# EasyEDA Pro project 51PCB_Project.eprj, schematic Schematic1
Board Name: Board1; Create Date: 2024-12-29; Page Name: P1; Project Name: 51PCB_Project_2024-12-29_14-04-50; Schematic Name: Schematic1; Update Date: 2024-12-30; Company: 嘉立创EDA; Page Size: A3; Version: V1.0
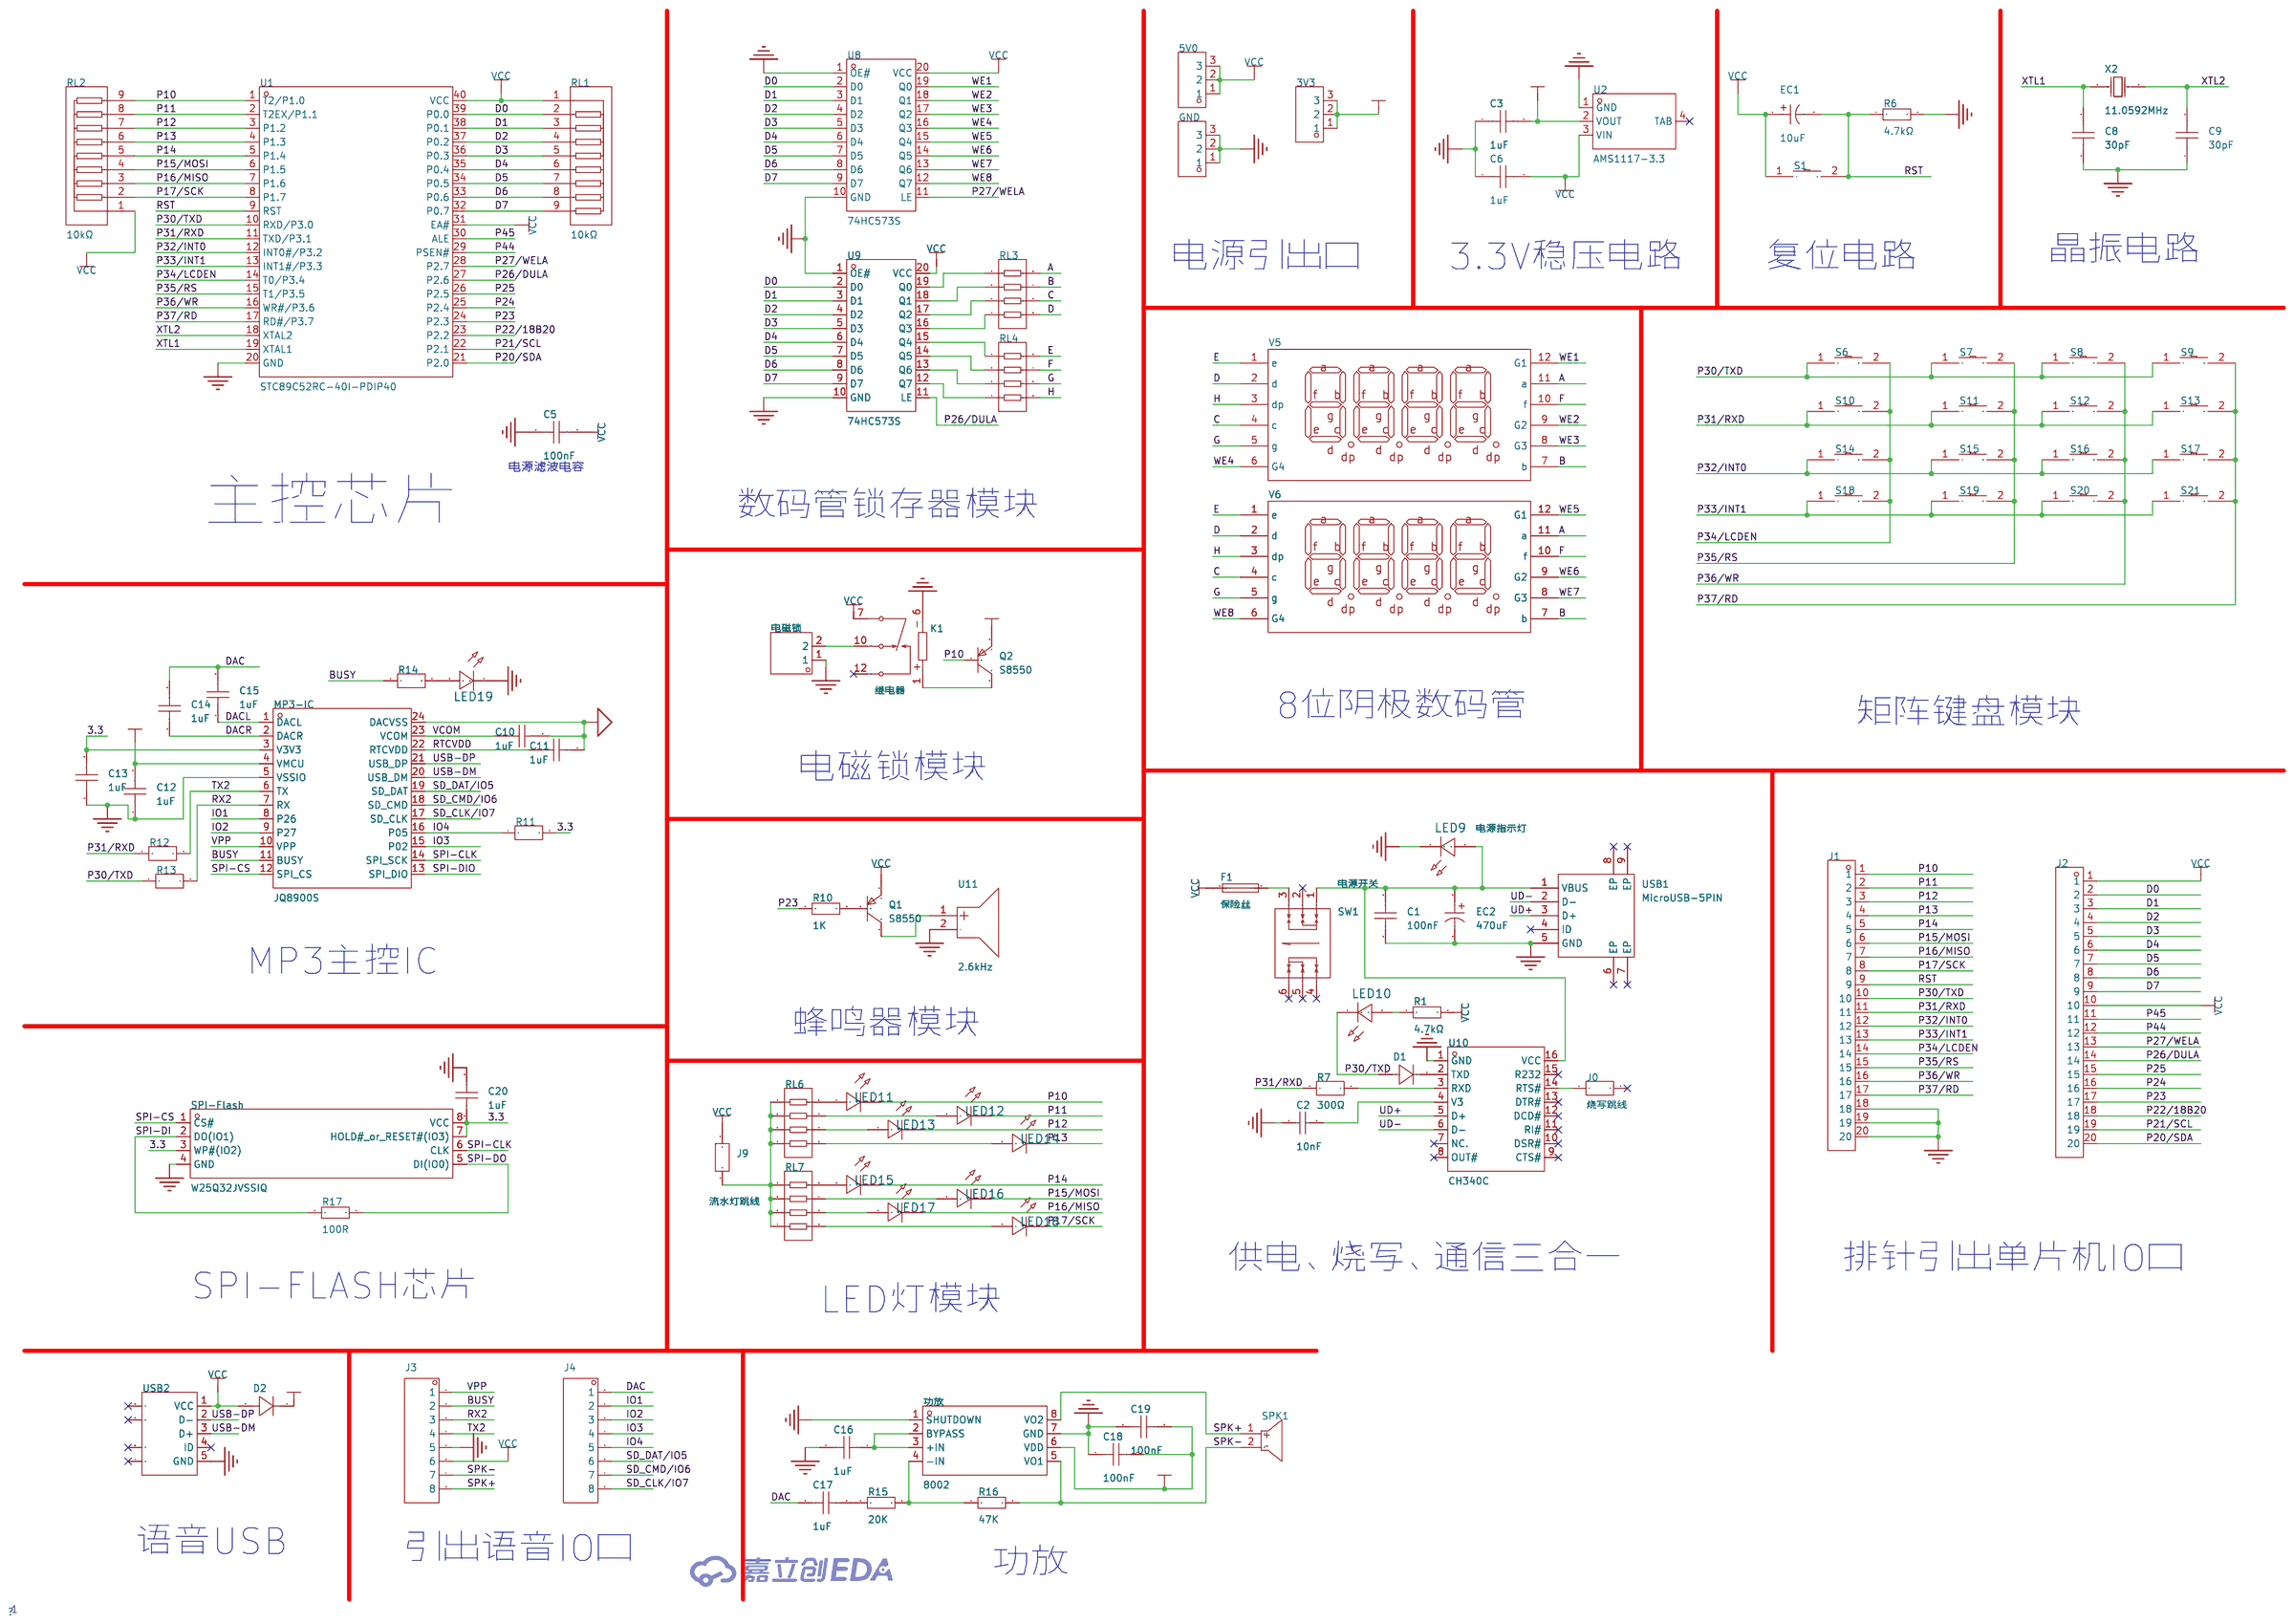
[diagram p0: schematic sheet]

## Parts
3V3  -  [HDR-TH_3P-P2.54-V-M]
5V0  -  [HDR-TH_3P-P2.54-V-M]
C1  100nF  [CAP-TH_L6.5-W3.5-P2.50-D0.6-S2.90]
C2  10nF  [C1206]
C3  1uF  [CAP-TH_L5.5-W3.5-P5.00-D1.2]
C5  100nF  [CAP-TH_L5.0-W2.5-P5.00-D1.0]
C6  1uF  [CAP-TH_L5.5-W3.5-P5.00-D1.2]
C8  30pF  [CAP-TH_L5.0-W3.0-P5.00-D1.0]
C9  30pF  [CAP-TH_L5.0-W3.0-P5.00-D1.0]
C10  1uF  [CAP-TH_L5.5-W3.5-P5.00-D1.2]
C11  1uF  [CAP-TH_L5.5-W3.5-P5.00-D1.2]
C12  1uF  [CAP-TH_L5.5-W3.5-P5.00-D1.2]
C13  1uF  [CAP-TH_L5.5-W3.5-P5.00-D1.2]
C14  1uF  [CAP-TH_L5.5-W3.5-P5.00-D1.2]
C15  1uF  [CAP-TH_L5.5-W3.5-P5.00-D1.2]
C16  1uF  [CAP-TH_L5.5-W3.5-P5.00-D1.2]
C17  1uF  [CAP-TH_L5.5-W3.5-P5.00-D1.2]
C18  100nF  [C0603]
C19  100nF  [C0603]
C20  1uF  [CAP-TH_L5.5-W3.5-P5.00-D1.2]
D1  -  [DO_1N4007]
D2  -  [DO_1N4007]
EC1  10uF  [CAP-SMD_BD6.3-L6.6-W6.6-LS7.2-FD]
EC2  470uF  [CAP-TH_BD16.0-P7.50-D1.2-FD]
F1  保险丝  [F1812]
GND  -  [HDR-TH_3P-P2.54-V-M]
J0  烧写跳线  [CONN-TH_D3086XX]
J1  -  [HDR-TH_20P-P2.54-V-M-1]
J2  -  [HDR-TH_20P-P2.54-V-M-1]
J3  -  [HDR-TH_8P-P2.54-V-M]
J4  -  [HDR-TH_8P-P2.54-V-M]
J9  流水灯跳线  [CONN-TH_D3086XX]
K1  继电器  [RELAY-TH_DS1E-S-DC24V]
LED9  电源指示灯  [LED_0805]
LED10  -  [LED_0805]
LED11  -  [LED_0805]
LED12  -  [LED_0805]
LED13  -  [LED_0805]
LED14  -  [LED_0805]
LED15  -  [LED_0805]
LED16  -  [LED_0805]
LED17  -  [LED_0805]
LED18  -  [LED_0805]
LED19  -  [LED_0805]
MP3-IC  JQ8900S  [TSSOP-24_L7.8-W4.4-P0.65-LS6.4-BL_1]
Q1  S8550  [SOT-23-3_L2.9-W1.3-P1.90-LS2.4-BR]
Q2  S8550  [SOT-23-3_L2.9-W1.3-P1.90-LS2.4-BR]
R1  4.7kΩ  [R1206]
R6  4.7kΩ  [RES-TH_BD1.9-L3.3-P7.30-D0.5]
R7  300Ω  [R1206]
R10  1K  [R1206]
R11  300Ω  [R1206]
R12  300Ω  [R1206]
R13  300Ω  [R1206]
R14  300Ω  [R1206]
R15  20K  [R0603]
R16  47K  [R0603]
R17  100R  [R0603]
RL1  10kΩ  [RES-ARRAY-TH_9P-P2.54-D1.0]
RL2  10kΩ  [RES-ARRAY-TH_9P-P2.54-D1.0]
RL3  470Ω  [RES-ARRAY-TH_8P-P2.54-D1.0]
RL4  470Ω  [RES-ARRAY-TH_8P-P2.54-D1.0]
RL6  470Ω  [RES-ARRAY-TH_8P-P2.54-D1.0]
RL7  470Ω  [RES-ARRAY-TH_8P-P2.54-D1.0]
S1  TS-1101-C-W  [SW-SMD_L6.0-W3.3-LS8.0]
S6  TS-1101-C-W  [SW-SMD_L6.0-W3.3-LS8.0]
S7  TS-1101-C-W  [SW-SMD_L6.0-W3.3-LS8.0]
S8  TS-1101-C-W  [SW-SMD_L6.0-W3.3-LS8.0]
S9  TS-1101-C-W  [SW-SMD_L6.0-W3.3-LS8.0]
S10  TS-1101-C-W  [SW-SMD_L6.0-W3.3-LS8.0]
S11  TS-1101-C-W  [SW-SMD_L6.0-W3.3-LS8.0]
S12  TS-1101-C-W  [SW-SMD_L6.0-W3.3-LS8.0]
S13  TS-1101-C-W  [SW-SMD_L6.0-W3.3-LS8.0]
S14  TS-1101-C-W  [SW-SMD_L6.0-W3.3-LS8.0]
S15  TS-1101-C-W  [SW-SMD_L6.0-W3.3-LS8.0]
S16  TS-1101-C-W  [SW-SMD_L6.0-W3.3-LS8.0]
S17  TS-1101-C-W  [SW-SMD_L6.0-W3.3-LS8.0]
S18  TS-1101-C-W  [SW-SMD_L6.0-W3.3-LS8.0]
S19  TS-1101-C-W  [SW-SMD_L6.0-W3.3-LS8.0]
S20  TS-1101-C-W  [SW-SMD_L6.0-W3.3-LS8.0]
S21  TS-1101-C-W  [SW-SMD_L6.0-W3.3-LS8.0]
SPI-Flash  W25Q32JVSSIQ  [SOIC-8_L5.3-W5.3-P1.27-LS8.0-BL]
SPK1  FS-2308  [BEEP-TH_BD23.2-P9.20-D1.0]
SW1  电源开关  [SW-TH_6P-L8.0-W8.0-P2.50]
U1  STC89C52RC-40I-PDIP40  [DIP-40_L52.0-W13.7-P2.54-LS15.2-BL]
U2  AMS1117-3.3  [SOT-223-3_L6.5-W3.5-P3.05-LS7.0]
U8  74HC573S  [SOIC-20_L13.0-W7.6-P1.27-LS10.3-BL]
U9  74HC573S  [SOIC-20_L13.0-W7.6-P1.27-LS10.3-BL]
U10  CH340C  [SOP-16_L10.0-W3.9-P1.27-LS6.0-BL]
U11  2.6kHz  [BUZ-TH_BD12.0-P7.60-D0.6-FD]
USB1  MicroUSB-5PIN  [USB-SMD_5P_MICROUSB-5PIN]
USB2  -  [USB_MINI-5P]
V5  FJ3461AH  [LED-SEG-TH_12P-L30.0-W14.0-P2.54-S10.16-BL]
V6  FJ3461AH  [LED-SEG-TH_12P-L30.0-W14.0-P2.54-S10.16-BL]
X2  11.0592MHz  [HC-49US_L11.5-W4.5-P4.88]
功放  8002  [SOP-8_L4.9-W3.9-P1.27-LS6.0-BL]
电磁锁  -  [HDR-TH_2P-P2.54-V-M-1]

## Library data of the parts
3V3 5V0 GND = HDR-M_2.54_1x3P: Supplier Part: C2937625; Supplier Footprint: 插件
C1 = CC1H104ZA1FD3F6C1100: 容值:100nF;精度:-20%~+80%;额定电压:50V;温度系数:Y5V;; LCSC Part Name: 100nF -20%~+80% 50V; Supplier Part: C5442939; Manufacturer: Dersonic(德尔创); Supplier Footprint: 插件,P=2.54mm; JLCPCB Part Class: 扩展库; Datasheet: https://atta.szlcsc.com/upload/public/pdf/source/20240808/2E4F22AECAD8A963CB56DA9A5AABDB6C.pdf; Supplier: LCSC; Tolerance: -20%~+80%; Voltage Rated: 50V; Lead Spacing: 2.54mm; Temperature Coefficient: Y5V; Diameter: 6.3mm; Body Thickness: 2.6mm
C2 = 1206B103K500NT: 容值:10nF;精度:±10%;额定电压:50V;材质(温度系数):X7R;; LCSC Part Name: 10nF ±10% 50V; Supplier Part: C1846; Manufacturer: FH(风华); Supplier Footprint: 1206; JLCPCB Part Class: 基础库; Datasheet: https://atta.szlcsc.com/upload/public/pdf/source/20200305/C486355_26A10D38EF8C2A5C37091D0039909270.pdf; Supplier: LCSC; Tolerance: ±10%; Voltage Rated: 50V; Temperature Coefficient: X7R
C3 C6 C10-C17 C20 = FK26X7R1H105KRE06: 容值:1uF;精度:±10%;额定电压:50V;温度系数:X7R;; LCSC Part Name: 1uF ±10% 50V; Supplier Part: C2839237; Manufacturer: TDK; Supplier Footprint: 插件,P=5mm; JLCPCB Part Class: 扩展库; Datasheet: https://atta.szlcsc.com/upload/public/pdf/source/20211011/CA0C243CD946D294CDFF83D03DB16AD9.pdf; Supplier: LCSC; Tolerance: ±10%; Voltage Rated: 50V; Lead Spacing: 5mm; Temperature Coefficient: X7R
C5 = CC1H104MC1FD3F6C10MF: 容值:100nF;精度:±20%;额定电压:50V;温度系数:Y5V;; LCSC Part Name: 100nF ±20% 50V; Supplier Part: C254085; Manufacturer: Dersonic(德尔创); Supplier Footprint: 插件,P=5.08mm; JLCPCB Part Class: 扩展库; Datasheet: https://atta.szlcsc.com/upload/public/pdf/source/20200826/C254085_159DD65BF32BF11C9168D341BCE23E6F.pdf; Supplier: LCSC; Tolerance: ±20%; Voltage Rated: 50V; Lead Spacing: 5.08mm; Temperature Coefficient: Y5V; φD: 6mm; Body Thickness: 2.2mm
C8 C9 = DCC300J20COHF6FJ5A0: 容值:30pF;精度:±5%;额定电压:50V;温度系数:-;; LCSC Part Name: 30pF ±5% 50V; Supplier Part: C2896130; Manufacturer: SHM(南方宏明); Supplier Footprint: 插件,P=5mm; JLCPCB Part Class: 扩展库; Datasheet: https://atta.szlcsc.com/upload/public/pdf/source/20210929/2675BE423E96B4772DBF330AE545E239.pdf; Supplier: LCSC; Tolerance: ±5%; Voltage Rated: 50V; Lead Spacing: 5mm
C18 C19 = CAP_0603: Supplier Footprint: 0603
D1 D2 = D_1N4007A: Supplier Footprint: DO-41
EC1 = MVK50V10M6.3*5: 容值:10uF;精度:±20%;额定电压:50V;纹波电流:29mA@120Hz;; LCSC Part Name: 10uF ±20% 50V; Supplier Part: C20539336; Manufacturer: SAMYOUNG(韩国三莹); Supplier Footprint: SMD,D6xL5mm; JLCPCB Part Class: 扩展库; Datasheet: https://atta.szlcsc.com/upload/public/pdf/source/20240521/5D58DF344D335CF011E1C9E4B9E4E338.pdf; Supplier: LCSC; Tolerance: ±20%; Rated Voltage: 50V; Ripple Current: 29mA@120Hz; φD: 6.3mm; L: 5mm; Lifetime @ Temp: 1000hrs@105℃; Operating Temperature: -40℃~+105℃
EC2 = NXH100VB470M16*31.5 LO: 容值:470uF;精度:±20%;额定电压:100V;纹波电流:2.4A@100kHz;等效串联电阻:33mΩ@100kHz;; LCSC Part Name: 470uF ±20% 100V; Supplier Part: C18164658; Manufacturer: SAMYOUNG(韩国三莹); Supplier Footprint: 插件,D16xL31.5mm; JLCPCB Part Class: 扩展库; Datasheet: https://atta.szlcsc.com/upload/public/pdf/source/20230919/BD77242C9D8CDAC24569F504DC077A1F.pdf; Supplier: LCSC; Tolerance: ±20%; Rated Voltage: 100V; Ripple Current: 2.4A@100kHz; Equivalent Series Resistance(ESR): 33mΩ@100kHz; Lead Spacing: 7.5mm; φD: 16mm; L: 31.5mm; Lifetime @ Temp: 10000hrs@105℃; Operating Temperature: -40℃~+105℃
F1 = BSMD1812-050-33V: 最大电压:33V;最大电流:40A;保持电流:500mA;跳闸电流:1A;; LCSC Part Name: 1812 0.5A 33V 自恢复; Supplier Part: C19673875; Manufacturer: BHFUSE(佰宏); Supplier Footprint: 1812; JLCPCB Part Class: 扩展库; Datasheet: https://atta.szlcsc.com/upload/public/pdf/source/20231215/5A8D3E85C128E7D194F97EE066518474.pdf; Supplier: LCSC; Operating Voltage (Max): 33V; Current Rating (Max): 40A; Hold Current: 500mA; Trip Current: 1A; Power Dissipation: 800mW; Resistance - Initial (Ri) (Min): 150mΩ; Resistance - Post Trip (R1) (Max): 1.4Ω; Maximum Time to Trip: 150ms; Operating Temperature: -40℃~+85℃
J0 J9 = D3086-97: LCSC Part Name: 跳线(母线), 短路, 短路链接, H3161, H3163系列 PC板插座, 2 路, 5.08 mm, Harwin - D308; Supplier Part: C20627105; Manufacturer: Harwin; JLCPCB Part Class: 扩展库; Datasheet: https://atta.szlcsc.com/upload/public/pdf/source/20240229/F1227681D81E34D7B1C6299A6A390718.pdf; Supplier: LCSC
J1 J2 = HDR-M_2.54_1x20P: 间距:2.54mm;总PIN位数:20;排数:1;插针结构:-;行距:-;安装类型:直插;圆针/方针:-;额定电流:-;额定电压:-;配合针长度:-;塑高:-;触头材质:黄铜;触头镀层:-;颜色:黑色;; Supplier Part: C50981; Supplier Footprint: 插件
J3 J4 = HDR-M_2.54_1x8P: Supplier Part: C124381; Supplier Footprint: 插件
K1 = DS1E-M-DC12V: 线圈电压:12V;触点形式:一组转换:1C(单刀双掷-转换);触点容量(电阻负载):-;最大切换电压:250V@AC；220V@DC;最大切换电流:2A;; Supplier Part: C4402944; Manufacturer: PANASONIC(松下); Supplier Footprint: 插件,9.9x15mm; JLCPCB Part Class: 扩展库; Datasheet: https://atta.szlcsc.com/upload/public/pdf/source/20220714/971BAC34C55B3A522BD74814F24FED99.pdf; Supplier: LCSC; Coil Voltage: 12V; Contact Form: 一组转换:1C(单刀双掷-转换); Maximum Switching Voltage: 250V@AC；220V@DC; Contact Material: 银+镀金; Maximum Switching Current: 2A; Operate Time: 10ms; Release Time: 5ms; Operating Temperature: -40℃~+70℃
LED9-LED19 = LED_0805-R: Supplier Footprint: 0805
MP3-IC = JQ8900S: Supplier Part: C9900042556; Supplier Footprint: TSSOP24; Supplier: LCSC
Q1 Q2 = S8550: LCSC Part Name: PNP -25V -500mA 120-400 SOT-23; Supplier Part: C2931720; Manufacturer: Doeshare(德芯); Supplier Footprint: SOT-23; JLCPCB Part Class: 扩展库; Datasheet: https://atta.szlcsc.com/upload/public/pdf/source/20220104/15A23F6542E365B9E2BA018BE45092B6.pdf; Supplier: LCSC
R1 = 1206W4F4701T5E: 电阻类型:厚膜电阻;阻值:4.7kΩ;精度:±1%;功率:250mW;最大工作电压:200V;温度系数:±100ppm/℃;; LCSC Part Name: 4.7kΩ ±1% 250mW 厚膜电阻; Supplier Part: C17936; Manufacturer: UNI-ROYAL(厚声); Supplier Footprint: 1206; JLCPCB Part Class: 基础库; Datasheet: https://atta.szlcsc.com/upload/public/pdf/source/20200306/C422600_1E6D84923E4A46A82E41ADD87F860B5C.pdf; Supplier: LCSC; Type: 厚膜电阻; Tolerance: ±1%; Power(Watts): 250mW; Overload Voltage (Max): 200V; Temperature Coefficient: ±100ppm/℃; Operating Temperature Range: -55℃~+155℃
R6 = MFR0W8F4701A50: 电阻类型:金属膜电阻;阻值:4.7kΩ;精度:±1%;功率:125mW;温度系数:±50ppm/℃;; LCSC Part Name: 4.7kΩ ±1% 125mW 金属膜电阻; Supplier Part: C58678; Manufacturer: UNI-ROYAL(厚声); Supplier Footprint: 插件,D1.9xL3.3mm; JLCPCB Part Class: 扩展库; Datasheet: https://atta.szlcsc.com/upload/public/pdf/source/20191012/C436293_8820AA14BC71FA35E551C06C441482A0.pdf; Supplier: LCSC; Type: 金属膜电阻; Tolerance: ±1%; Overload Voltage (Max): 200V; Power(Watts): 125mW; Temperature Coefficient: ±50ppm/℃
R7 R11-R14 = FRC1206J301 TS: 电阻类型:厚膜电阻;阻值:300Ω;精度:±5%;功率:250mW;最大工作电压:200V;温度系数:±100ppm/℃;; LCSC Part Name: 300Ω ±5% 250mW 厚膜电阻; Supplier Part: C3013269; Manufacturer: FOJAN(富捷); Supplier Footprint: 1206; JLCPCB Part Class: 扩展库; Datasheet: https://atta.szlcsc.com/upload/public/pdf/source/20211221/925EC7D7225764EE0046F22065062C87.pdf; Supplier: LCSC; Type: 厚膜电阻; Tolerance: ±5%; Power(Watts): 250mW; Overload Voltage (Max): 200V; Temperature Coefficient: ±100ppm/℃
R10 = Res_1206: Supplier Footprint: 1206
R15-R17 = Res_0603: Supplier Footprint: 0603
RL1 RL2 = A09-103GP: 电阻器数:8;阻值:10kΩ;精度:±2%;单个元件功率:125mW;温度系数:±100ppm/℃;; LCSC Part Name: 10kΩ ±2%; Supplier Part: C1322401; Manufacturer: FH(风华); Supplier Footprint: SIP-9-2.54mm; JLCPCB Part Class: 扩展库; Datasheet: https://atta.szlcsc.com/upload/public/pdf/source/20181127/C336620_2E84FA9E7B5BF76546BC661699514FB8.pdf; Supplier: LCSC; Number of Resistors: 8; Tolerance: ±2%; Power(Watts): 125mW; Temperature Coefficient: ±100ppm/℃; Number of Pins: 9
RL3 RL4 RL6 RL7 = 4608X-102-471LF: 电阻器数:4;阻值:470Ω;精度:±2%;单个元件功率:300mW;温度系数:±100ppm/℃;; LCSC Part Name: 470Ω ±2%; Supplier Part: C1357983; Manufacturer: BOURNS; Supplier Footprint: SIP-8-2.54mm; JLCPCB Part Class: 扩展库; Datasheet: https://atta.szlcsc.com/upload/public/pdf/source/20210602/12BA461036BFCE8593BA6D5AE69068B1.pdf; Supplier: LCSC; Number of Resistors: 4; Tolerance: ±2%; Power(Watts): 300mW; Temperature Coefficient: ±100ppm/℃; Number of Pins: 8
S1 S6-S21 = TS-1101-C-W: 电路结构:单刀单掷;按钮形状:矩形按钮;作用力:260gf;安装方式:立贴;开关长度:6mm;开关宽度:3.6mm;开关高度:2.5mm;带支架:不带;触点电流:50mA;额定电压(AC):-;额定电压(DC):12V;额定功率:-;绝缘电阻:-;带灯:无;机械寿命:5万次;; LCSC Part Name: 6*3.6*2.5mm 立贴 轻触开关; Supplier Part: C318938; Manufacturer: XKB Connectivity(中国星坤); Supplier Footprint: SMD; JLCPCB Part Class: 扩展库; Datasheet: https://atta.szlcsc.com/upload/public/pdf/source/20200227/C318938_C2E53B1EEDE37D980A33616AC086DE53.pdf; Supplier: LCSC; Circuit: 单刀单掷; Actuator Style: 矩形按钮; Operating Force: 260gf; Mounting Style: 立贴; Switch Length: 6mm; Switch Width: 3.6mm; Switch Height: 2.5mm; Strike Gundam: 不带; Contact Current: 50mA; Voltage Rating (DC): 12V; Actuator/Cap Color: 白色带淡绿; With Lamp: 无; Mechanical Life: 5万次; Operating Temperature: -30℃~+85℃
SPI-Flash = W25Q32JVSSIQ: Supplier Part: C179173; Manufacturer: WINBOND(华邦); Supplier Footprint: SOIC-8-208mil; JLCPCB Part Class: 扩展库; Datasheet: https://atta.szlcsc.com/upload/public/pdf/source/20191218/C179173_5BBD793D2D7B3672E140BC7AE85C11FF.pdf; Supplier: LCSC
SPK1 = FS-2308: LCSC Part Name: 喇叭23MM-8.0H 8Ω1W 插针; Supplier Part: C482322; Manufacturer: FUET(福声科技); JLCPCB Part Class: 扩展库; Datasheet: https://atta.szlcsc.com/upload/public/pdf/source/20200113/C482322_D09CD61BAFBB8D4AD64070E01BFD18FF.pdf; Supplier: LCSC
SW1 = 8-8 ZS: 电路结构:双刀双掷;自锁/无锁:自锁;安装方式:直插;触点电流:100mA;额定电压 (AC):-;额定电压 (DC):30V;带灯:不带;作用力:180gf;机械寿命:5千次;; LCSC Part Name: 按键开关8x8 自锁高头 180gf; Supplier Part: C5379893; Manufacturer: SHOU HAN(首韩); Supplier Footprint: 插件; JLCPCB Part Class: 扩展库; Datasheet: https://atta.szlcsc.com/upload/public/pdf/source/20230920/344D9C55231D4D6DD37BED301252459B.pdf; Supplier: LCSC; Circuit: 双刀双掷; Self Lock / No Lock: 自锁; Actuator Style: 矩形柱塞; Mounting Style: 直插; Contact Current: 100mA; Voltage Rating (DC): 30V; Insulation Resistance: 100MΩ; Actuator/Cap Color: 蓝色; With Lamp: 不带; Pin Style: PC引脚; Operating Force: 180gf; Operating Temperature: -10℃~+70℃; Mechanical Life: 5千次
U1 = STC89C52RC-40I-PDIP40: CPU内核:51系列;程序存储容量:8KB;RAM总容量:512Byte;GPIO端口数量:35;工作电压范围:3.3V~5.5V;CPU最大主频:-;程序存储器类型:FLASH;; Supplier Part: C14022; Manufacturer: STC(宏晶); Supplier Footprint: DIP-40; JLCPCB Part Class: 扩展库; Datasheet: https://atta.szlcsc.com/upload/public/pdf/source/20210104/C14022_3E6032FDBB5DBC6F971AD019A8472F5B.pdf; Supplier: LCSC; CPU Core: 51系列; Program Storage Size: 8KB; RAM Size: 512Byte; GPIO Ports Number: 35; Operating Voltage Range: 3.3V~5.5V; Program Memory Type: FLASH; Operating Temperature Range: -40℃~+85℃; 16Bit Timer: 3; UART/USART: 1; Peripheral/Function: 看门狗; Watchdog: 有
U2 = AMS1117-3.3_C5250992: 输出类型:固定;工作电压:12V;输出电压:3.3V;输出电流:1A;电源纹波抑制比(PSRR):70dB@(120Hz);输出极性:正极;; Supplier Part: C5250992; Manufacturer: TWGMC(台湾迪嘉); Supplier Footprint: SOT-223-3L; JLCPCB Part Class: 扩展库; Datasheet: https://atta.szlcsc.com/upload/public/pdf/source/20221109/A58A92B07670E85D28928AE371260E8D.pdf; Supplier: LCSC; Output Type: 固定; Maximum Input Voltage: 12V; Output Voltage: 3.3V; Output Current: 1A; Power Supply Rejection Ratio (PSRR): 70dB@(120Hz); Operating Temperature: -40℃~+125℃@(Tj); Output Polarity: 正极; Number of Outputs: 1
U8 U9 = 74HC573S: Supplier Part: C19818872; Manufacturer: GR(国睿); Supplier Footprint: SOIC-20-300mil; JLCPCB Part Class: 扩展库; Datasheet: https://atta.szlcsc.com/upload/public/pdf/source/20231226/FCD51D65E6130A1C21F1588DDAB191FD.pdf; Supplier: LCSC
U10 = CH340C: 应用功能:收发器;接口协议:USB 2.0;数据速率:2Mbps;; LCSC Part Name: CH340C USB转串口芯片 CH340; Supplier Part: C84681; Manufacturer: WCH(南京沁恒); Supplier Footprint: SOP-16; JLCPCB Part Class: 扩展库; Datasheet: https://atta.szlcsc.com/upload/public/pdf/source/20240619/63986D8440D4E5267A77ACD891CC4DE3.pdf; Supplier: LCSC; Applications Function: 收发器; Protocol: USB 2.0; Supply Voltage: 3.3V；5V; Data Rate: 2Mbps
U11 = HYE1206-12ST: 频率:2.6kHz;声压(SPL):85dB@12V,10cm;; LCSC Part Name: 有源蜂鸣器HYE1206-12ST; Supplier Part: C17701080; Manufacturer: HYDZ(华宇); Supplier Footprint: 插件,D=7.6mm; Datasheet: https://atta.szlcsc.com/upload/public/pdf/source/20230912/C7366A61A43818688751ED674836836E.pdf; Supplier: LCSC; Sound Pressure Level (SPL): 85dB@12V,10cm
USB1 = MicroUSB-5PIN: Supplier Part: C9900001196; Supplier Footprint: MicroUSB-5PIN,; JLCPCB Part Class: 扩展库; Supplier: LCSC
USB2 = USB_Mini-B: Supplier Footprint: SMD; Supplier: LCSC
V5 V6 = FJ3461AH: 数码管位数:4位;功耗:-;发光颜色:红色;LED极性:共阴极;数字/字母大小(英寸):0.36;; LCSC Part Name: 4位0.36英寸红色数码管 共阴极; Supplier Part: C10708; Manufacturer: 志浩; Supplier Footprint: 插件; JLCPCB Part Class: 扩展库; Datasheet: https://atta.szlcsc.com/upload/public/pdf/source/20121231/1457706574766.pdf; Supplier: LCSC; Number of Characters: 4位; Module Size: 30mmx14mmx7.2mm; Luminous Color: 红色; LED Polarity: 共阴极; Digit/Alpha Size(inch): 0.36
X2 = X49SD110592MSD2SC: 晶振类型:直插晶振;频率:11.0592MHz;常温频差:±20ppm;外接负载电容:20pF;频率稳定度(全温):±30ppm;; LCSC Part Name: 11.0592MHz ±20ppm 20pF; Supplier Part: C2203; Manufacturer: YXC(扬兴晶振); Supplier Footprint: HC-49S; JLCPCB Part Class: 扩展库; Datasheet: https://atta.szlcsc.com/upload/public/pdf/source/20240329/977D7F2434F98B2BE33270BB9FF3D86D.pdf; Supplier: LCSC; Crystal Type: 直插晶振; Normal temperature Frequency Tolerance: ±20ppm; External load capacitor: 20pF; Frequency Stability(Full temperature range): ±30ppm; Operating Temperature: -20℃~+70℃
功放 = 8002: 功率放大器; LCSC Part Name: Aip8002; Supplier Part: C5139016; Manufacturer: I-CORE(中微爱芯); Supplier Footprint: SOP-8; JLCPCB Part Class: 扩展库; Datasheet: https://atta.szlcsc.com/upload/public/pdf/source/20220816/03501F7F7652C9F9E3FDDA0D1837E9DD.pdf; Supplier: LCSC
电磁锁 = HDR-M_2.54_1x2P: Supplier Part: C124375; Supplier Footprint: 插件

## Nets
AGND: C10.2 C11.2 MP3-IC.24(DACVSS)
GND: C1.1 C2.1 C3.1 C5.1 C6.1 C8.1 C9.1 C12.1 C13.1 C16.2 C18.1 C19.1 C20.1 EC2.2 GND.1 GND.2 GND.3 J1.18 J1.19 J1.20 J3.5 K1.6 LED9.1(C) LED19.1(C) MP3-IC.5(VSSIO) R6.2 SPI-Flash.4(GND) U1.20(GND) U2.1(GND) U8.1(OE#) U8.10(GND) U9.1(OE#) U9.10(GND) U10.1(GND) U11.2(-) USB1.5(GND) USB2.5(GND) 功放.1(SHUTDOWN) 功放.7(GND) 电磁锁.1
VCC: 5V0.1 5V0.2 5V0.3 C5.2 C6.2 D2.2(A) EC1.1 F1.1 J2.1 J2.10 J3.6 J9.2 K1.7 Q1.2(E) R1.2 RL1.1 RL2.1 S1.1 U1.31(EA#) U1.40(VCC) U2.3(VIN) U8.20(VCC) U9.20(VCC) USB2.1(VCC)
3.3: C13.2 C20.2 MP3-IC.3(V3V3) R11.2 SPI-Flash.3(WP#(IO2)) SPI-Flash.7(HOLD# or RESET#(IO3)) SPI-Flash.8(VCC)
+3.3: 3V3.1 3V3.2 3V3.3 C3.2 Q2.2(E) U2.2(VOUT)
A: RL3.8 V5.11(a) V6.11(a)
B: RL3.7 V5.7(b) V6.7(b)
BUSY: J3.2 MP3-IC.11(BUSY) R14.1
C: RL3.6 V5.4(c) V6.4(c)
D: RL3.5 V5.2(d) V6.2(d)
D0: J2.2 RL1.2 U1.39(P0.0) U8.2(D0) U9.2(D0)
D1: J2.3 RL1.3 U1.38(P0.1) U8.3(D1) U9.3(D1)
D2: J2.4 RL1.4 U1.37(P0.2) U8.4(D2) U9.4(D2)
D3: J2.5 RL1.5 U1.36(P0.3) U8.5(D3) U9.5(D3)
D4: J2.6 RL1.6 U1.35(P0.4) U8.6(D4) U9.6(D4)
D5: J2.7 RL1.7 U1.34(P0.5) U8.7(D5) U9.7(D5)
D6: J2.8 RL1.8 U1.33(P0.6) U8.8(D6) U9.8(D6)
D7: J2.9 RL1.9 U1.32(P0.7) U8.9(D7) U9.9(D7)
DAC: C14.2 C15.2 C17.2 J4.1
DACL: C15.1 MP3-IC.1(DACL)
DACR: C14.1 MP3-IC.2(DACR)
E: RL4.8 V5.1(e) V6.1(e)
F: RL4.7 V5.10(f) V6.10(f)
G: RL4.6 V5.5(g) V6.5(g)
H: RL4.5 V5.3(dp) V6.3(dp)
IO1: J4.2 MP3-IC.8(P26)
IO2: J4.3 MP3-IC.9(P27)
IO3: J4.4 MP3-IC.15(P02)
IO4: J4.5 MP3-IC.16(P05) R11.1
P10: J1.1 LED11.1(C) Q2.1(B) RL2.9 U1.1(T2/P1.0)
P11: J1.2 LED12.1(C) RL2.8 U1.2(T2EX/P1.1)
P12: J1.3 LED13.1(C) RL2.7 U1.3(P1.2)
P13: J1.4 LED14.1(C) RL2.6 U1.4(P1.3)
P14: J1.5 LED15.1(C) RL2.5 U1.5(P1.4)
P15/MOSI: J1.6 LED16.1(C) RL2.4 U1.6(P1.5)
P16/MISO: J1.7 LED17.1(C) RL2.3 U1.7(P1.6)
P17/SCK: J1.8 LED18.1(C) RL2.2 U1.8(P1.7)
P20/SDA: J2.20 U1.21(P2.0)
P21/SCL: J2.19 U1.22(P2.1)
P22/18B20: J2.18 U1.23(P2.2)
P23: J2.17 R10.1 U1.24(P2.3)
P24: J2.16 U1.25(P2.4)
P25: J2.15 U1.26(P2.5)
P26/DULA: J2.14 U1.27(P2.6) U9.11(LE)
P27/WELA: J2.13 U1.28(P2.7) U8.11(LE)
P30/TXD: D1.2(A) J1.10 LED10.1(C) R13.1 S6.1 S7.1 S8.1 S9.1 U1.10(RXD/P3.0)
P31/RXD: J1.11 R7.1 R12.1 S10.1 S11.1 S12.1 S13.1 U1.11(TXD/P3.1)
P32/INT0: J1.12 S14.1 S15.1 S16.1 S17.1 U1.12(INT0#/P3.2)
P33/INT1: J1.13 S18.1 S19.1 S20.1 S21.1 U1.13(INT1#/P3.3)
P34/LCDEN: J1.14 S6.2 S10.2 S14.2 S18.2 U1.14(T0/P3.4)
P35/RS: J1.15 S7.2 S11.2 S15.2 S19.2 U1.15(T1/P3.5)
P36/WR: J1.16 S8.2 S12.2 S16.2 S20.2 U1.16(WR#/P3.6)
P37/RD: J1.17 S9.2 S13.2 S17.2 S21.2 U1.17(RD#/P3.7)
P44: J2.12 U1.29(PSEN#)
P45: J2.11 U1.30(ALE)
RST: EC1.2 J1.9 R6.1 S1.2 U1.9(RST)
RTCVDD: C11.1 MP3-IC.22(RTCVDD)
RX2: J3.3 MP3-IC.7(RX) R13.2
SD_CLK/IO7: J4.8 MP3-IC.17(SD_CLK)
SD_CMD/IO6: J4.7 MP3-IC.18(SD_CMD)
SD_DAT/IO5: J4.6 MP3-IC.19(SD_DAT)
SPI-CLK: MP3-IC.14(SPI_SCK) SPI-Flash.6(CLK)
SPI-CS: MP3-IC.12(SPI_CS) SPI-Flash.1(CS#)
SPI-DI: R17.1 SPI-Flash.2(DO(IO1))
SPI-DIO: MP3-IC.13(SPI_DIO)
SPI-DO: R17.2 SPI-Flash.5(DI(IO0))
SPK+: J3.8 SPK1.1 功放.8(VO2)
SPK-: J3.7 R16.2 SPK1.2 功放.5(VO1)
TX2: J3.4 MP3-IC.6(TX) R12.2
UD+: U10.5(D+) USB1.3(D+)
UD-: U10.6(D-) USB1.2(D-)
USB-DM: MP3-IC.20(USB_DM) USB2.3(D+)
USB-DP: MP3-IC.21(USB_DP) USB2.2(D-)
VCOM: C10.1 MP3-IC.23(VCOM)
VMCU: C12.2 C18.2 C19.2 D2.1(K) MP3-IC.4(VMCU) 功放.6(VDD)
VPP: J3.1 MP3-IC.10(VPP)
WE1: U8.19(Q0) V5.12(G1)
WE2: U8.18(Q1) V5.9(G2)
WE3: U8.17(Q2) V5.8(G3)
WE4: U8.16(Q3) V5.6(G4)
WE5: U8.15(Q4) V6.12(G1)
WE6: U8.14(Q5) V6.9(G2)
WE7: U8.13(Q6) V6.8(G3)
WE8: U8.12(Q7) V6.6(G4)
XTL1: C8.2 U1.19(XTAL1) X2.2(OSC2)
XTL2: C9.2 U1.18(XTAL2) X2.1(OSC1)
$1N5616: RL3.1 U9.19(Q0)
$1N5618: RL3.2 U9.18(Q1)
$1N5620: RL3.3 U9.17(Q2)
$1N5622: RL3.4 U9.16(Q3)
$1N5624: RL4.1 U9.15(Q4)
$1N5626: RL4.2 U9.14(Q5)
$1N5628: RL4.3 U9.13(Q6)
$1N5630: RL4.4 U9.12(Q7)
$1N8009: F1.2 SW1.3
$1N8347: C1.2 EC2.1 LED9.2(A) SW1.1 U10.16(VCC) USB1.1(VBUS)
$1N8729: D1.1(K) U10.2(TXD)
$1N8914: LED10.2(A) R1.1
$1N9036: R7.2 U10.3(RXD)
$1N9212: C2.2 U10.4(V3)
$1N9264: J0.1 U10.14(RTS#)
$1N9436: LED11.2(A) RL6.8
$1N9463: LED12.2(A) RL6.7
$1N9490: LED13.2(A) RL6.6
$1N9517: LED14.2(A) RL6.5
$1N9544: LED15.2(A) RL7.8
$1N9571: LED16.2(A) RL7.7
$1N9598: LED17.2(A) RL7.6
$1N9625: LED18.2(A) RL7.5
$1N9867: J9.1 RL6.1 RL6.2 RL6.3 RL6.4 RL7.1 RL7.2 RL7.3 RL7.4
$1N10308: Q1.1(B) R10.2
$1N10336: Q1.3(C) U11.1(+)
$1N10560: K1.1 Q2.3(C)
$1N10700: K1.10 电磁锁.2
$1N11856: LED19.2(A) R14.2
$1N12078: C16.1 功放.2(BYPASS) 功放.3(+IN)
$1N12197: C17.1 R15.1
$1N12208: R15.2 R16.1 功放.4(-IN)

Not connected (* = marked no-connect by the designer): J0 2*; K1 12*; SW1 2* 4* 5* 6*; U2 4(TAB)*; U10 7(NC.)* 8(OUT#)* 9(CTS#)* 10(DSR#)* 11(RI#)* 12(DCD#)* 13(DTR#)* 15(R232)*; USB1 4(ID)* 6(EP)* 7(EP)* 8(EP)* 9(EP)*; USB2 4(ID)* 6(EH)* 7(EH)* 8(EH)* 9(EH)*

## Notes on the sheet
- 电源引出口
- 3.3V稳压电路
- 复位电路
- 晶振电路
- 电源滤波电容
- 数码管锁存器模块
- 主控芯片
- 8位阴极数码管
- 矩阵键盘模块
- 电磁锁模块
- MP3主控IC
- 蜂鸣器模块
- 供电、烧写、通信三合一
- 排针引出单片机IO口
- SPI-FLASH芯片
- LED灯模块
- 语音USB
- 引出语音IO口
- 功放
